# Altium project OpenTag3.PrjPCB
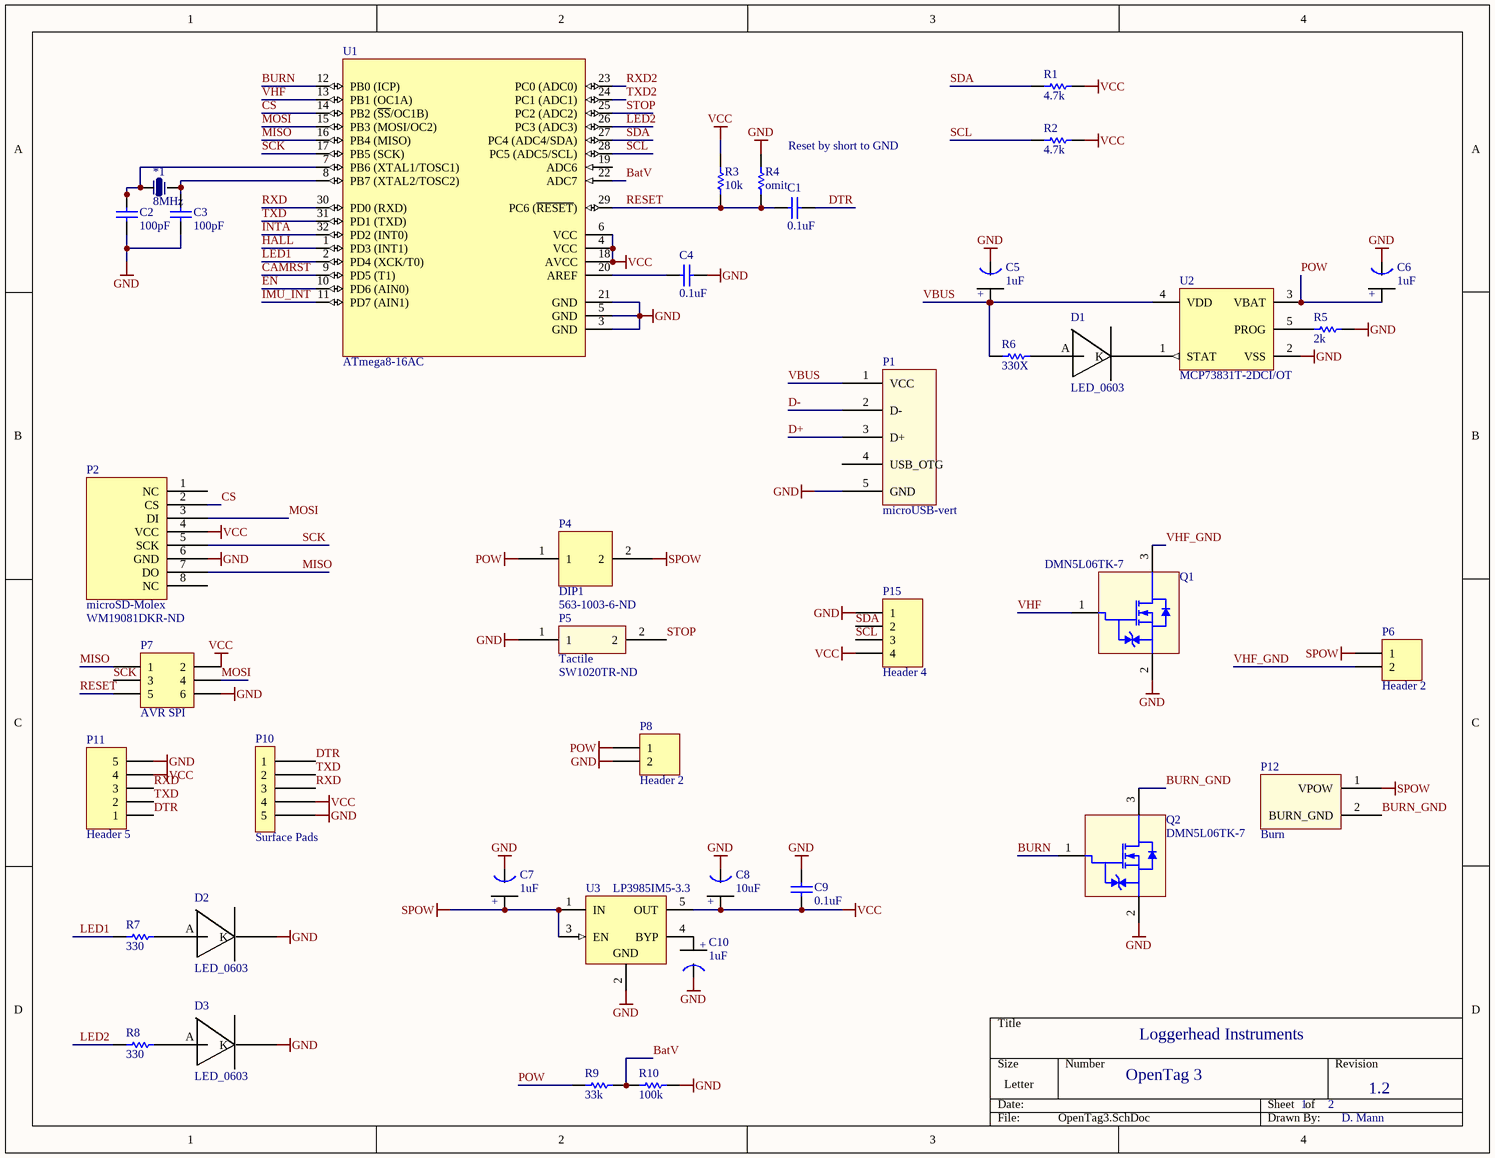
[diagram p0: OpenTag3.SchDoc]
2 sheets, 62 parts. Net scope: global (net labels, ports and power ports of the same name join across sheets).
Board file: OpenTag3.PcbDoc
Sheets:
  OpenTag3.SchDoc
  OpenTag3_Sensors.SchDoc

## Sheet OpenTag3.SchDoc
size Letter

### Parts
*1  8MHz  [XTAL-ABM3]
C1  0.1uF  [0402]
C2  100pF  [0402]
C3  100pF  [0402]
C4  0.1uF  [0402]
C5  1uF  [Tant0805]
C6  1uF  [Tant0805]
C7  1uF  [Tant0805]
C8  10uF  [Tant0805]
C9  0.1uF  [0402]
C10  1uF  [Tant0805]
D1  LED_0603  [Diode0603]
D2  LED_0603  [Diode0603]
D3  LED_0603  [Diode0603]
P1  microUSB-vert  [MICROUSB-VERT]
P2  microSD-Molex  Supplier Part Number 1: WM19081DKR-ND  [microSD_Molex_hinged]
P4  DIP1  Supplier Part Number 1: 563-1003-6-ND  [DIP1]
P5  Tactile  Supplier Part Number 1: SW1020TR-ND  [Tactile-B3U-1000]
P6  Header 2  [HDR1X2]
P7  AVR SPI  [HDR2X3]
P8  Header 2  [HDR1X2]
P10  Surface Pads  [Surface Pads 5 x 2mm]
P11  Header 5  [HDR1X5]
P12  Burn  [BURN]
P15  Header 4  [HDR1X4]
Q1  DMN5L06TK-7  [SOT-523]
Q2  DMN5L06TK-7  [SOT-523]
R1  4.7k  [3-0603]
R2  4.7k  [3-0603]
R3  10k  [3-0603]
R4  omit  [3-0603]
R5  2k  [3-0603]
R6  330X  [3-0603]
R7  330  [3-0603]
R8  330  [3-0603]
R9  33k  [3-0603]
R10  100k  [3-0603]
U1  ATmega8-16AC  [32M1-A_M]
U2  MCP73831T-2DCI/OT  [SOT-23-OT5_N]
U3  LP3985IM5-3.3  [MF05A_N]

### Nets
GND: C2.1 C3.1 C4.2 C5.1(GND) C6.1(GND) C7.1(GND) C8.1(GND) C9.2 C10.1(GND) D2.K D3.K P1.5(GND) P2.6(GND) P5.1 P7.6 P8.2 P10.5 P11.5 P15.1 Q1.2(S) Q2.2(S) R4.2 R5.1 R10.1 U1.3(GND) U1.5(GND) U1.21(GND) U2.2(VSS) U3.2(GND)
POW: C6.2(+) P4.1 P8.1 R9.2 U2.3(VBAT)
SPOW: C7.2(+) P4.2 P6.1 P12.1(VPOW) U3.1(IN) U3.3(EN)
VCC: C8.2(+) C9.1 P2.4(VCC) P7.2 P10.4 P11.4 P15.4 R1.2 R2.2 R3.2 U1.4(VCC) U1.6(VCC) U1.18(AVCC) U3.5(OUT)
BatV: R9.1 R10.2 U1.22(ADC7)
BURN: Q2.1(G) U1.12(PB0_(ICP))
BURN_GND: P12.2(BURN_GND) Q2.3(D)
CAMRST: U1.9(PD5_(T1))
CS: P2.2(CS) U1.14(PB2_(~{SS}/OC1B))
D+: P1.3(D+)
D-: P1.2(D-)
DTR: C1.2 P10.1 P11.1
EN: U1.10(PD6_(AIN0))
HALL: U1.1(PD3_(INT1))
IMU_INT: U1.11(PD7_(AIN1))
INTA: U1.32(PD2_(INT0))
LED1: R7.1 U1.2(PD4_(XCK/T0))
LED2: R8.1 U1.26(PC3_(ADC3))
MISO: P2.7(DO) P7.1 U1.16(PB4_(MISO))
MOSI: P2.3(DI) P7.4 U1.15(PB3_(MOSI/OC2))
RESET: C1.1 P7.5 R3.1 R4.1 U1.29(PC6_(~{RESET}))
RXD: P10.3 P11.3 U1.30(PD0_(RXD))
RXD2: U1.23(PC0_(ADC0))
SCK: P2.5(SCK) P7.3 U1.17(PB5_(SCK))
SCL: P15.3 R2.1 U1.28(PC5_(ADC5/SCL))
SDA: P15.2 R1.1 U1.27(PC4_(ADC4/SDA))
STOP: P5.2 U1.25(PC2_(ADC2))
TXD: P10.2 P11.2 U1.31(PD1_(TXD))
TXD2: U1.24(PC1_(ADC1))
VBUS: C5.2(+) P1.1(VCC) R6.1 U2.4(VDD)
VHF: Q1.1(G) U1.13(PB1_(OC1A))
VHF_GND: P6.2 Q1.3(D)
Net*1_1: *1.1 C2.2 U1.7(PB6_(XTAL1/TOSC1))
Net*1_2: *1.2 C3.2 U1.8(PB7_(XTAL2/TOSC2))
NetC4_1: C4.1 U1.20(AREF)
NetC10_2: C10.2(+) U3.4(BYP)
NetD1_A: D1.A R6.2
NetD1_K: D1.K U2.1(STAT)
NetD2_A: D2.A R7.2
NetD3_A: D3.A R8.2
NetR5_2: R5.2 U2.5(PROG)

Not connected (* = marked no-connect by the designer): P1 4(USB_OTG); P2 1(NC) 8(NC); U1 19(ADC6)

### Notes on the sheet
- (near R4) Reset by short to GND
- Loggerhead Instruments
- OpenTag 3
- 1
- 2
- 1.2
- D. Mann

### Library data of the parts
*1 = XTAL-ABM3
C1-C4 C9 = C0402: Ceramic Chip Capacitor - Standard; Note: Footprint corresponds to dimensions for bulk cassette packaging. This case size has tightened tolerances.; Published: 17-Jul-2002; LatestRevisionDate: 19-Mar-2004; LatestRevisionNote: Silkscreen size reduced.; DatasheetDocument: Mar-2001; PackageDocument: Mar-2001; PackageReference: 0402; Publisher: Altium Limited; Code_JEITA: 0402; Code_IPC: 1005 [0402]; ComponentLink1Description: Manufacturer Link; ComponentLink1URL: http://www.kemet.com/; ComponentLink2Description: Datasheet; ComponentLink2URL: http://www.kemet.com/kemet/web/homepage/kechome.nsf/vapubfilesname/F3102TA.pdf/$file/F3102TA.pdf
  C1 C4 C9: Value: 0.1uF
  C2 C3: Value: 100pF
C5-C8 C10 = Tant0805
  C5 C6: Value: *
  C7 C10: Value: 1uF
  C8: Value: 10uF
P1 = microUSB-vert: Molex 105133-0011
P2 = microSD_Molex_hinged: Supplier 1: Digi-Key
P5 = Tactile_B3U-1000: Supplier 1: Digi-Key
P6 P8 = Header 2: Header, 2-Pin; LatestRevisionDate: 17-Jul-2002; LatestRevisionNote: Re-released for DXP Platform.; Publisher: Altium Limited
P7 = Header 3X2: Header, 3-Pin, Dual row; LatestRevisionDate: 17-Jul-2002; LatestRevisionNote: Re-released for DXP Platform.; Publisher: Altium Limited
P10 = SurfacePads 5x2mm
P11 = Header 5: Header, 5-Pin; LatestRevisionDate: 17-Jul-2002; LatestRevisionNote: Re-released for DXP Platform.; Publisher: Altium Limited
P12 = Burn Screw
P15 = Header 4: Header, 4-Pin; LatestRevisionDate: 17-Jul-2002; LatestRevisionNote: Re-released for DXP Platform.; Publisher: Altium Limited
Q1 Q2 = FET DMN5L06TK-7: Ultra-low leakage Enhanced MOSFET; Fabrication Tested: NO; Creator and Date: Will Flanery 2010-09-02; Footprint Verified By: *; Schematic Verified By: *; Vendor Info Verified By: *; Supplier 1: Digi-Key; Supplier Part Number 1: DMN5L06TKDICT-ND; HelpURL: http://www.diodes.com/datasheets/ds30926.pdf
R1-R10 = ERJ3RK: Precision Thick Film Chip Resistor, 10 Ohm to 1M Ohm Range, 1% and 0.5% Tolerance, 0603 Size, 0.063 W; Published: 17-Dec-2003; LatestRevisionDate: 19-Mar-2004; LatestRevisionNote: Silkscreen size reduced.; PackageDocument: Mar-2003; PackageReference: 3-0603; Publisher: Altium Limited; Code_IPC: 1608 [0603]; ComponentLink1Description: Manufacturer Link; ComponentLink1URL: http://www.panasonic.com/industrial/components/resistive_products.htm; ComponentLink2Description: Datasheet; ComponentLink2URL: http://www.panasonic.com/industrial/components/pdf/AOA0000CE2.pdf
U1 = ATmega8-16AC: 8-Bit AVR Microcontroller with 8K Bytes of In-System Programmable Flash Memory; Published: 17-Sep-2003; LatestRevisionDate: 13-Apr-2006; LatestRevisionNote: IPC-7351 Footprint Added.; DatasheetVersion: 2486H-AVR-09/02; PackageVersion: revB, Oct-2001; PackageReference: 32A; Publisher: Altium Limited; PackageDescription: 32-Pin Thin Quad Flat Pack 0.8 mm Pitch; Code_JEDEC: MS-026-ABA; ComponentLink1Description: Manufacturer Link; ComponentLink1URL: http://www.atmel.com; ComponentLink2Description: Datasheet; ComponentLink2URL: http://www.atmel.com/dyn/resources/prod_documents/doc2486.pdf
U2 = MCP73831T-2DCI/OT: Miniature Single-Cell, Fully Integrated Li-Ion, Li-Polymer Charge Management Controller, 4.2V, 5-Pin SOT-23, Industrial Temperature, Tape and Reel; DatasheetVersion: revE, Sep-2008; PackageVersion: revBB, Aug-2009; PackageReference: SOT-23-OT5; PackageDescription: 5-Lead Plastic Small Outline Transistor (OT) [SOT-23]; Code_IPC: SOT23-5; ComponentLink1Description: Manufacturer URL; ComponentLink1URL: http://www.microchip.com/; ComponentLink2Description: Datasheet; ComponentLink2URL: http://ww1.microchip.com/downloads/en/DeviceDoc/21984e.pdf; ComponentLink3Description: Package Specification; ComponentLink3URL: http://www.microchip.com/stellent/groups/techpub_sg/documents/packagingspec/en012702.pdf
U3 = LP3985IM5-3.3: Micropower, 150mA Low-Noise Ultra Low-Dropout CMOS Voltage Regulator; Manufacturer: National Semiconductor; CompType: LDO IC; PackageTopMarking: LDQB*XTT; PowerWise: N; Published: 4-Dec-2008; DatasheetVersion: Aug-2005; PackageVersion: revD, Aug-2008; PackageReference: MF05A; Publisher: Altium Limited; PackageDescription: Molded SOT-23, .115 x .063 x .040 in Body, 5 Lead, .0375 in Pitch; PartNumber: LP3985IM5-3.3; RoHS: O; PinCount: 5; DigiKeyPartNumber: LP3985IM5-3.3CT-ND; ComponentLink1Description: LP3985 Datasheet; ComponentLink1URL: http://www.national.com/ds/LP/LP3985.pdf; ComponentLink2Description: LP3985 Web Page; ComponentLink2URL: http://www.national.com/pf/LP/LP3985.html; ComponentLink3Description: MF05A Package Page; ComponentLink3URL: http://www.national.com/packaging/folders/mf05a.html
P4 = DIP1: Supplier 1: Digi-Key

## Sheet OpenTag3_Sensors.SchDoc
size A
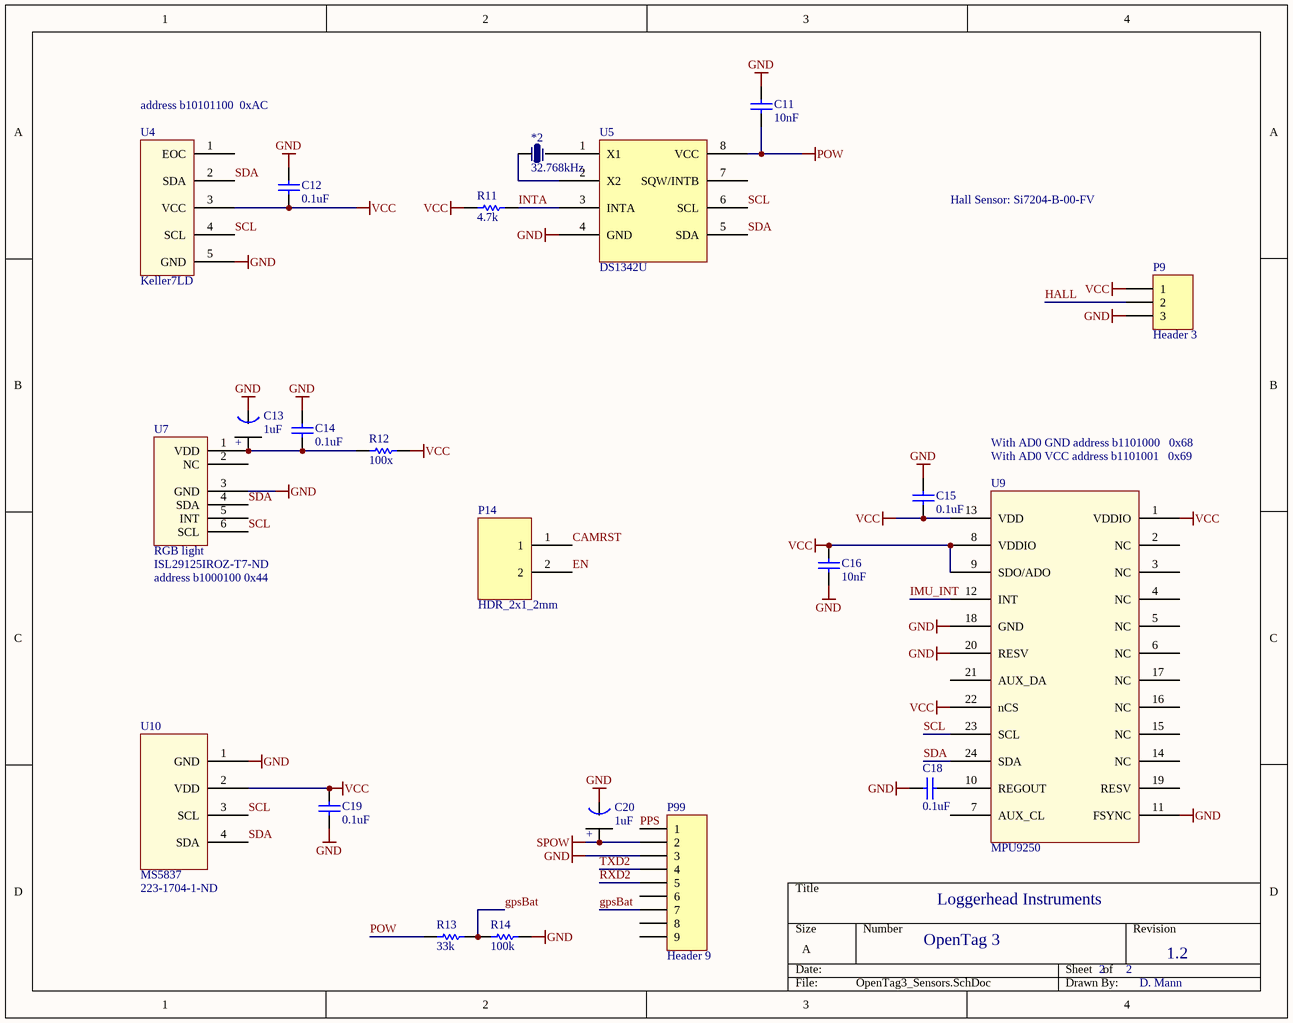
[diagram p1: OpenTag3_Sensors.SchDoc]

### Parts
*2  32.768kHz  [XTAL-ABS06]
C11  10nF  [0402]
C12  0.1uF  [0402]
C13  1uF  [Tant0805]
C14  0.1uF  [0402]
C15  0.1uF  [0402]
C16  10nF  [0402]
C18  0.1uF  [0402]
C19  0.1uF  [0402]
C20  1uF  [Tant0805]
P9  Header 3  [HDR1X3]
P14  HDR_2x1_2mm  [HDR_2x1_2mm]
P99  Header 9  [HDR1X9]
R11  4.7k  [3-0603]
R12  100x  [3-0603]
R13  33k  [3-0603]
R14  100k  [3-0603]
U4  Keller7LD  [Keller7LD]
U5  DS1342U  [uSOP8]
U7  RGB light  Supplier Part Number 1: ISL29125IROZ-T7-ND  [ODFN]
U9  MPU9250  [MPU6500]
U10  MS5837  Supplier Part Number 1: 223-1704-1-ND  [MS5837]

### Nets
GND: C11.1 C12.2 C13.1(GND) C14.2 C15.2 C16.2 C18.1 C19.1 C20.1(GND) P9.3 P99.3 R14.1 U4.5(GND) U5.4(GND) U7.3(GND) U9.11(FSYNC) U9.18(GND) U9.20(RESV) U10.1(GND)
POW: C11.2 R13.2 U5.8(VCC)
SPOW: C20.2(+) P99.2
VCC: C12.1 C15.1 C16.1 C19.2 P9.1 R11.1 R12.1 U4.3(VCC) U9.1(VDDIO) U9.8(VDDIO) U9.9(SDO/ADO) U9.13(VDD) U9.22(nCS) U10.2(VDD)
CAMRST: P14.1
EN: P14.2
gpsBat: P99.7 R13.1 R14.2
HALL: P9.2
IMU_INT: U9.12(INT)
INTA: R11.2 U5.3(INTA)
PPS: P99.1
RXD2: P99.5
SCL: U4.4(SCL) U5.6(SCL) U7.6(SCL) U9.23(SCL) U10.3(SCL)
SDA: U4.2(SDA) U5.5(SDA) U7.4(SDA) U9.24(SDA) U10.4(SDA)
TXD2: P99.4
Net*2_1: *2.1 U5.2(X2)
Net*2_2: *2.2 U5.1(X1)
NetC13_2: C13.2(+) C14.1 R12.2 U7.1(VDD)
NetC18_2: C18.2 U9.10(REGOUT)

Not connected (* = marked no-connect by the designer): P99 6 8 9; U4 1(EOC); U5 7(SQW/INTB); U7 2(NC) 5(INT); U9 2(NC) 3(NC) 4(NC) 5(NC) 6(NC) 7(AUX_CL) 14(NC) 15(NC) 16(NC) 17(NC) 19(RESV) 21(AUX_DA)

### Notes on the sheet
- (near U4) address b10101100  0xAC
- Hall Sensor: Si7204-B-00-FV
- With AD0 GND address b1101000   0x68
- With AD0 VCC address b1101001   0x69
- (near U7) address b1000100 0x44
- Loggerhead Instruments
- OpenTag 3
- 2
- 1.2
- D. Mann

### Library data of the parts
*2 = XTAL_ABS06
C11 C12 C14-C16 C18 C19 = C0402: as C1 on sheet OpenTag3; Published: 17-Jul-2002; LatestRevisionDate: 19-Mar-2004; LatestRevisionNote: Silkscreen size reduced.; DatasheetDocument: Mar-2001; PackageDocument: Mar-2001; PackageReference: 0402; Publisher: Altium Limited; Code_JEITA: 0402; Code_IPC: 1005 [0402]; ComponentLink1Description: Manufacturer Link; ComponentLink1URL: http://www.kemet.com/; ComponentLink2Description: Datasheet; ComponentLink2URL: http://www.kemet.com/kemet/web/homepage/kechome.nsf/vapubfilesname/F3102TA.pdf/$file/F3102TA.pdf
  C11 C16: Value: 10nF
  C12 C14 C15 C18 C19: Value: 0.1uF
C13 C20 = Tant0805: Value: 1uF
P9 = Header 3: Header, 3-Pin; LatestRevisionDate: 17-Jul-2002; LatestRevisionNote: Re-released for DXP Platform.; Publisher: Altium Limited
P99 = Header 9: Header, 9-Pin; LatestRevisionDate: 17-Jul-2002; LatestRevisionNote: Re-released for DXP Platform.; Publisher: Altium Limited
R11-R14 = ERJ3RK: as R1 on sheet OpenTag3; Published: 17-Dec-2003; LatestRevisionDate: 19-Mar-2004; LatestRevisionNote: Silkscreen size reduced.; PackageDocument: Mar-2003; PackageReference: 3-0603; Publisher: Altium Limited; Code_IPC: 1608 [0603]; ComponentLink1Description: Manufacturer Link; ComponentLink1URL: http://www.panasonic.com/industrial/components/resistive_products.htm; ComponentLink2Description: Datasheet; ComponentLink2URL: http://www.panasonic.com/industrial/components/pdf/AOA0000CE2.pdf
U4 = Keller 7LD: Keller Pressure/Temp; PDF: http://www.kelleramerica.com/pdf-library/Piezoresistive%20OEM%20Pressure%20Transmitters%20with%20I2C%20interface%20and%20embedded%20signal%20conditioning.pdf
U5 = DS1337
U7 = ISL29125: RGB light sensor; Supplier 1: Digi-Key
U9 = MPU-9250: Invensense
U10 = MS5837: Pressure/Temp; Supplier 1: Digi-Key

## Nets that join several sheets
GND: OpenTag3 (29 pins), OpenTag3_Sensors (19 pins)
POW: OpenTag3 (5 pins), OpenTag3_Sensors (C11.2 R13.2 U5.8)
SPOW: OpenTag3 (6 pins), OpenTag3_Sensors (C20.2 P99.2)
VCC: OpenTag3 (14 pins), OpenTag3_Sensors (14 pins)
CAMRST: OpenTag3 (U1.9), OpenTag3_Sensors (P14.1)
EN: OpenTag3 (U1.10), OpenTag3_Sensors (P14.2)
HALL: OpenTag3 (U1.1), OpenTag3_Sensors (P9.2)
IMU_INT: OpenTag3 (U1.11), OpenTag3_Sensors (U9.12)
INTA: OpenTag3 (U1.32), OpenTag3_Sensors (R11.2 U5.3)
RXD2: OpenTag3 (U1.23), OpenTag3_Sensors (P99.5)
SCL: OpenTag3 (P15.3 R2.1 U1.28), OpenTag3_Sensors (5 pins)
SDA: OpenTag3 (P15.2 R1.1 U1.27), OpenTag3_Sensors (5 pins)
TXD2: OpenTag3 (U1.24), OpenTag3_Sensors (P99.4)